# EAGLE design ISP_LPC9xx_USB_RE_v1.1 (EAGLE 5.11)
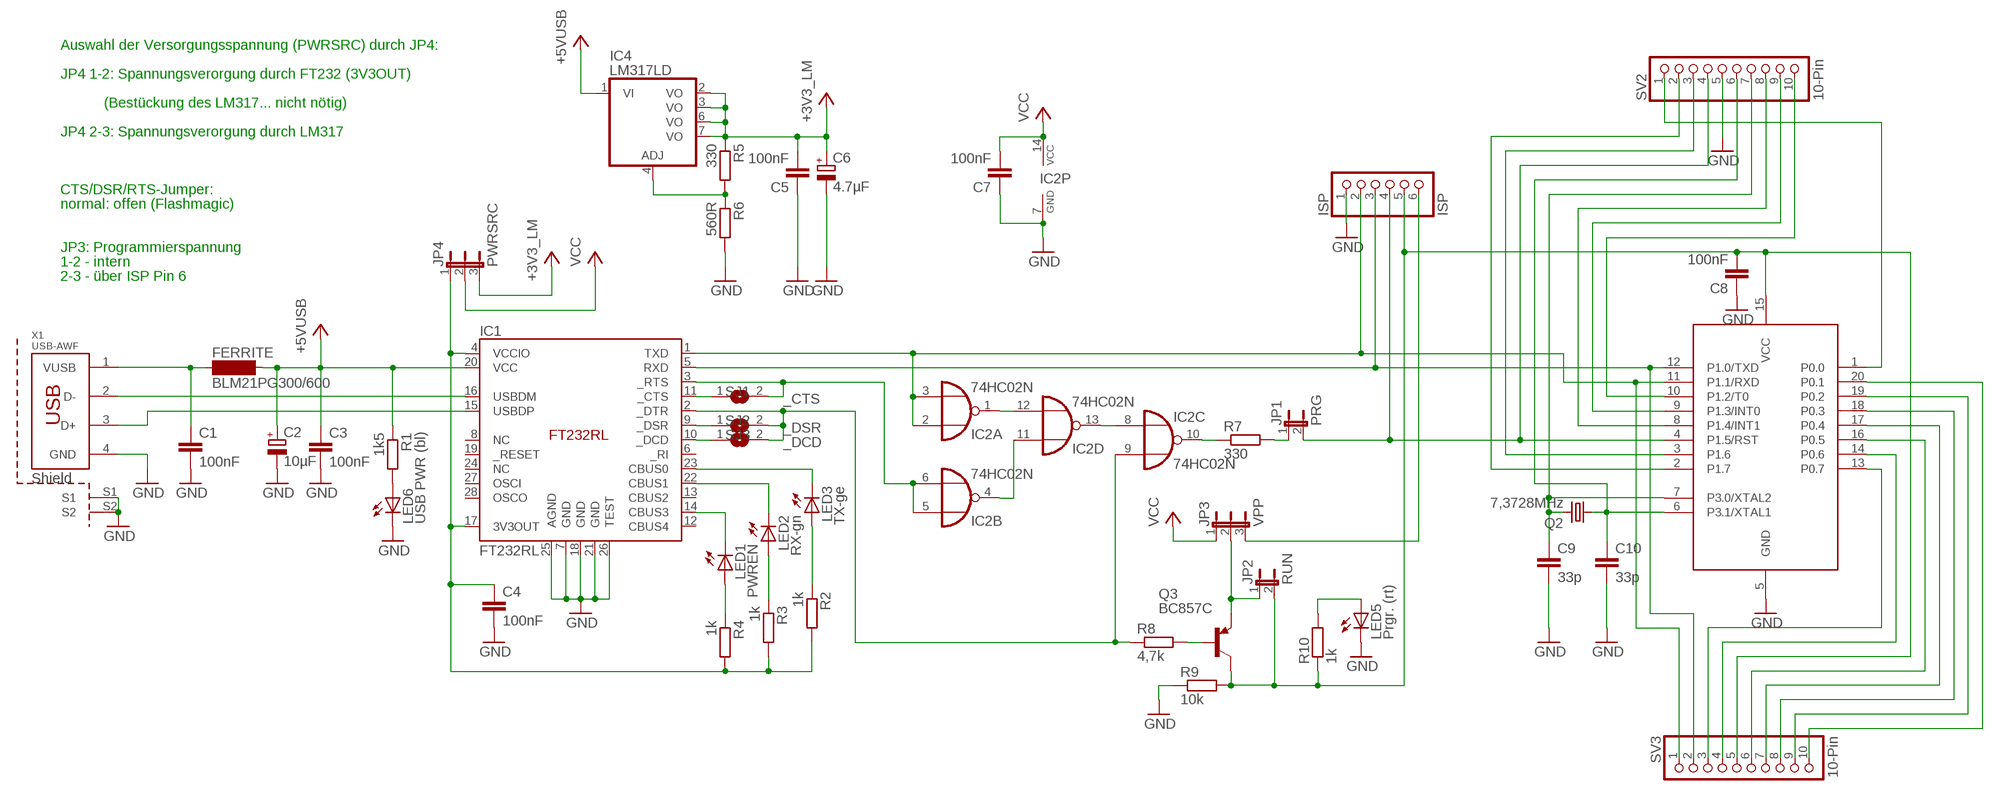
[diagram p0: schematic, sheet 1]

## Parts
C1  100nF  C-EUC0805K  [C0805K]
C2  10µF  CPOL-EU153CLV-0405  [153CLV-0405]
C3  100nF  C-EUC0805K  [C0805K]
C4  100nF  C-EUC0805K  [C0805K]
C5  100nF  C-EUC0805K  [C0805K]
C6  4.7µF  CPOL-EU153CLV-0405  [153CLV-0405]
C7  100nF  C-EUC0805K  [C0805K]
C8  100nF  C-EUC0805K  [C0805K]
C9  33p  C-EUC0805K  [C0805K]
C10  33p  C-EUC0805K  [C0805K]
FERRITE  BLM21PG300/600  SM-1206  [SM-1206]
IC1  FT232RL  [SSOP-28]
IC2  74HC02N  [DIL14]
IC4  LM317LD  [SO08]
ISP  ISP  PINHD-1X6  [1X06]
JP1  PRG  JP1E  [JP1]
JP2  RUN  JP1E  [JP1]
JP3  VPP  JP2E  [JP2]
JP4  PWRSRC  JP2E  [JP2]
LED1  PWREN  LEDCHIP-LED0805  [CHIP-LED0805]
LED2  RX-gn  LEDCHIP-LED0805  [CHIP-LED0805]
LED3  TX-ge  LEDCHIP-LED0805  [CHIP-LED0805]
LED5  Prgr. (rt)  LEDCHIP-LED0805  [CHIP-LED0805]
LED6  USB PWR (bl)  LEDCHIP-LED0805  [CHIP-LED0805]
Q2  7,3728MHz  CRYSTALHC49S  [HC49/S]
Q3  BC857C  BC857C-PNP-SOT23-BEC  [SOT23-BEC]
R1  1k5  R-EU_M1206  [M1206]
R2  1k  R-EU_M1206  [M1206]
R3  1k  R-EU_M1206  [M1206]
R4  1k  R-EU_M1206  [M1206]
R5  330  R-EU_M1206  [M1206]
R6  560R  R-EU_M1206  [M1206]
R7  330  R-EU_M1206  [M1206]
R8  4,7k  R-EU_M1206  [M1206]
R9  10k  R-EU_M1206  [M1206]
R10  1k  R-EU_M1206  [M1206]
SJ1  _CTS  SJ  [SJ]
SJ2  _DSR  SJ  [SJ]
SJ3  _DCD  SJ  [SJ]
SV2  10-Pin  PINHD-1X10  [1X10]
SV3  10-Pin  PINHD-1X10  [1X10]
U2  89LPC922  [DIL20]
X1  USB-AWF  USB-1X-2S-PLUG-A-THT  [USB-PLUG-A-THT-2S]

## Nets
+3V3: C5.2 C6.+ IC4.2(VO) IC4.3(VO) IC4.6(VO) IC4.7(VO) JP4.3 R5.1 ; supply symbol labelled +3V3_LM
+5V: C2.+ C3.1 FERRITE.2 IC1.20(VCC) IC4.1(VI) R1.1 ; supply symbol labelled +5VUSB
DSR_DCD_DTR: IC1.2(_DTR) IC2.9(C:I1) R8.1 SJ2.2 SJ3.2
GND: C1.2 C2.- C3.2 C4.2 C5.1 C6.- C7.1 C8.1 C9.2 C10.2 IC1.7(GND) IC1.18(GND) IC1.21(GND) IC1.25(AGND) IC1.26(TEST) IC2.7(P:GND) ISP.1 LED5.C LED6.C R6.2 R9.1 SV2.5 U2.5(GND) X1.4(GND) X1.S1 X1.S2
N$1: IC1.5(RXD) ISP.3 SV3.2 U2.12(P1.0/TXD)
N$2: C9.1 Q2.2 SV2.7 U2.7(P3.0/XTAL2)
N$3: IC2.4(B:O) IC2.11(D:I0)
N$4: JP2.1 JP3.2 Q3.E
N$5: ISP.4 JP1.2 SV2.4 U2.4(P1.5/RST)
N$6: C8.2 ISP.5 JP2.2 Q3.C R9.2 R10.1 SV3.5 U2.15(VCC)
N$7: ISP.6 JP3.3
N$8: IC1.1(TXD) IC2.2(A:I0) IC2.3(A:I1) ISP.2 SV3.1 U2.11(P1.1/RXD)
N$9: LED6.A R1.2
N$10: IC2.1(A:O) IC2.12(D:I1)
N$11: C10.1 Q2.1 SV2.6 U2.6(P3.1/XTAL1)
N$12: C4.1 IC1.4(VCCIO) IC1.17(3V3OUT) JP4.1 R2.2 R3.2 R4.2
N$13: LED5.A R10.2
N$14: IC1.16(USBDM) X1.2(D-)
N$15: IC2.8(C:I0) IC2.13(D:O)
N$16: IC4.4(ADJ) R5.2 R6.1
N$17: IC1.15(USBDP) X1.3(D+)
N$19: Q3.B R8.2
N$20: IC1.11(_CTS) SJ1.1
N$21: IC1.9(_DSR) SJ2.1
N$22: IC1.10(_DCD) SJ3.1
N$23: LED2.A R3.1
N$24: LED3.A R2.1
N$25: IC1.22(CBUS1) LED2.C
N$26: IC1.23(CBUS0) LED3.C
N$27: JP1.1 R7.2
N$28: IC2.10(C:O) R7.1
N$29: IC1.14(CBUS3) LED1.C
N$30: LED1.A R4.1
N$36: SV2.10 U2.10(P1.2/T0)
N$38: SV2.9 U2.9(P1.3/INT0)
N$39: SV2.8 U2.8(P1.4/INT1)
N$40: SV3.4 U2.14(P0.6)
N$41: SV2.3 U2.3(P1.6)
N$42: SV3.6 U2.16(P0.5)
N$43: SV2.2 U2.2(P1.7)
N$44: SV2.1 U2.1(P0.0)
N$45: SV3.3 U2.13(P0.7)
N$46: SV3.7 U2.17(P0.4)
N$47: C1.1 FERRITE.1 X1.1(VUSB)
N$48: SV3.8 U2.18(P0.3)
N$49: SV3.9 U2.19(P0.2)
N$50: SV3.10 U2.20(P0.1)
RTS_CTS1: IC1.3(_RTS) IC2.5(B:I0) IC2.6(B:I1) SJ1.2
VCC: C7.2 IC2.14(P:VCC) JP3.1 JP4.2
Unconnected: IC1.6(_RI) IC1.8(NC) IC1.12(CBUS4) IC1.13(CBUS2) IC1.19(_RESET) IC1.24(NC) IC1.27(OSCI) IC1.28(OSCO)

## Notes on the sheet
- Auswahl der Versorgungsspannung (PWRSRC) durch JP4:
- JP4 1-2: Spannungsverorgung durch FT232 (3V3OUT)
- (Bestückung des LM317... nicht nötig)
- JP4 2-3: Spannungsverorgung durch LM317
- CTS/DSR/RTS-Jumper:
- normal: offen (Flashmagic)
- JP3: Programmierspannung
- 1-2 - intern
- 2-3 - über ISP Pin 6

## Library data of the parts
C1 C3-C5 C7-C10 = rcl:C-EU: CAPACITOR, European symbol
C2 C6 = rcl:CPOL-EU: POLARIZED CAPACITOR, European symbol
FERRITE = inductor-neosid:SM-1206: INDUCTOR SMD chip inductor
IC1 = ftdi4:FT232RL
IC2 = 74xx-eu:74*02: Quad 2-input NOR gate
IC4 = linear:LM317LD: LOW CURRENT 1.2 TO 37V ADJUSTABLE VOLTAGE REGULATOR Source: http://pdf.alldatasheet.com
ISP = pinhead:PINHD-1X6: PIN HEADER
JP1 JP2 = jumper:JP1E: JUMPER
JP3 JP4 = jumper:JP2E: JUMPER
LED1-LED3 LED5 LED6 = led:LED: LED OSRAM: - CHIPLED LG R971, LG N971, LY N971, LG Q971, LY Q971, LO R971, LY R971 LH N974, LH R974 LS Q976, LO Q976, LY Q976 LO Q996 - Hyper CHIPLED LW Q18S LB Q993, LB Q99A, LB R99A - SideLED LS A670, LO A670, LY A670, LG A670, LP A670 LB A673, LV A673, LT A673, LW A673 LH A674 LY A675 LS A676, LA A676, LO A676, LY A676, LW A676 LS A679, LY A679, LG A679 - Hyper Micro SIDELED® LS Y876, LA Y876, LO Y876, LY Y876 LT Y87S - SmartLED LW L88C, LW L88S LB L89C, LB L89S, LG L890 LS L89K, LO L89K, LY L89K LS L896, LA L896, LO L896, LY L896 - TOPLED LS T670, LO T670, LY T670, LG T670, LP T670 LSG T670, LSP T670, LSY T670, LOP T670, LYG T670 LG T671, LOG T671, LSG T671 LB T673, LV T673, LT T673, LW T673 LH T674 LS T676, LA T676, LO T676, LY T676, LB T676, LH T676, LSB T676, LW T676 LB T67C, LV T67C, LT T67C, LS T67K, LO T67K, LY T67K, LW E67C LS E67B, LA E67B, LO E67B, LY E67B, LB E67C, LV E67C, LT E67C LW T67C LS T679, LY T679, LG T679 LS T770, LO T770, LY T770, LG T770, LP T770 LB T773, LV T773, LT T773, LW T773 LH T774 LS E675, LA E675, LY E675, LS T675 LS T776, LA T776, LO T776, LY T776, LB T776 LHGB T686 LT T68C, LB T68C - Hyper Mini TOPLED® LB M676 - Mini TOPLED Santana® LG M470 LS M47K, LO M47K, LY M47K Source: http://www.osram.convergy.de LUXEON: - LUMILED® LXK2-PW12-R00, LXK2-PW12-S00, LXK2-PW14-U00, LXK2-PW14-V00 LXK2-PM12-R00, LXK2-PM12-S00, LXK2-PM14-U00 LXK2-PE12-Q00, LXK2-PE12-R00, LXK2-PE12-S00, LXK2-PE14-T00, LXK2-PE14-U00 LXK2-PB12-K00, LXK2-PB12-L00, LXK2-PB12-M00, LXK2-PB14-N00, LXK2-PB14-P00, LXK2-PB14-Q00 LXK2-PR12-L00, LXK2-PR12-M00, LXK2-PR14-Q00, LXK2-PR14-R00 LXK2-PD12-Q00, LXK2-PD12-R00, LXK2-PD12-S00 LXK2-PH12-R00, LXK2-PH12-S00 LXK2-PL12-P00, LXK2-PL12-Q00, LXK2-PL12-R00 Source: www.luxeon.com KINGBRIGHT: KA-3528ASYC Source: www.kingbright.com
Q2 = crystal:CRYSTAL: CRYSTAL
Q3 = transistor:*-PNP-: PNP Transistror
R1-R10 = resistor:R-EU_: RESISTOR, European symbol
SJ1-SJ3 = jumper:SJ: SMD solder JUMPER
SV2 SV3 = pinhead:PINHD-1X10: PIN HEADER
U2 = micro-philips:89LPC922
X1 = _con-usb_1:USB-1X-2S: USB A/M USB Typ A / USB Typ B Ausführung SMD/THT/DIP, Side-Entry, Ultraflach 2x Shield Reichelt USB-AGF, USB-AWF

## Board
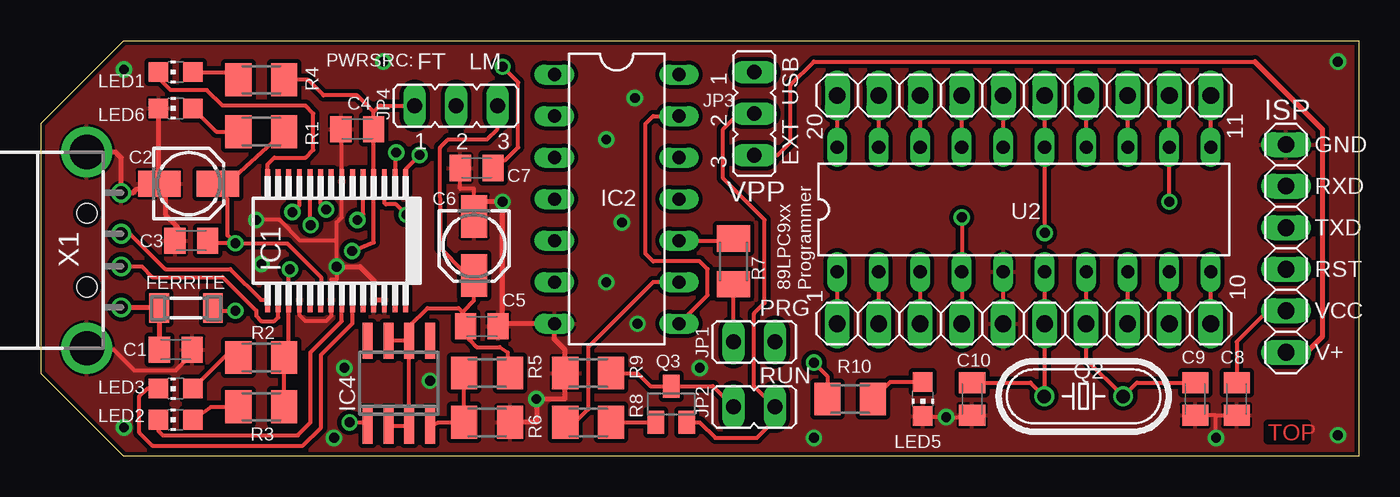
[diagram p1: board, top side]
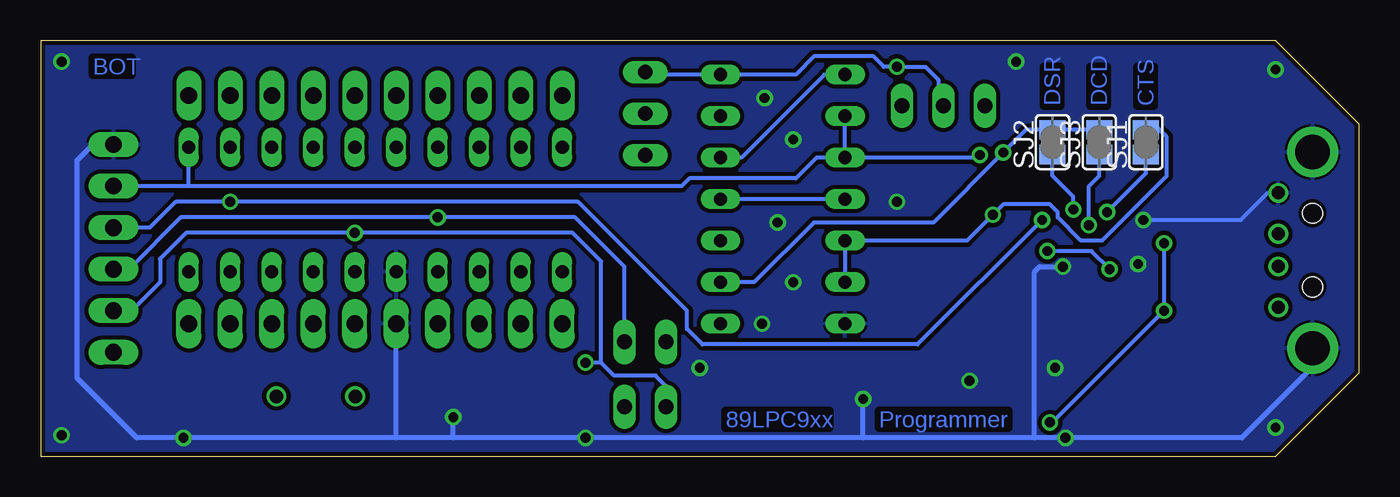
[diagram p2: board, bottom side, seen from below]

Size 80.65 x 25.4 mm. Coordinates in mm from the lower left corner, seen from the top.
Outline: 0,20.32 0,5.08 5.08,0 80.65,0 80.65,25.4 5.08,25.4 0,20.32
Copper layers (1*16): Top 0.035mm / dielectric 1.5mm / Bottom 0.035mm
Design rules "2layer_20110523": minimum track width 0.15mm, minimum drill 0.3mm, track to track 0.15mm, track to pad 0.15mm, pad to pad 0.15mm, via to via 0.15mm, smd to smd 0.15mm, copper to edge 0.15mm, drill to drill 0.2mm, minimum pad ring 0.15mm, minimum via ring 0.2mm, stop-mask expansion 0.15mm, vias tented up to drill 0.8mm, thermal gap 0.15mm

### Footprints (pad centres in the part's own frame; a part is rotated, then mirrored left to right if it is on the bottom)
C0805K = smd 1.3 x 1.6: 1 -1,0; 2 1,0
153CLV-0405 = smd 2.6 x 1.6: + 1.8,0; - -1.8,0
SM-1206 = smd 1.2 x 1.8: 1 -1.65,0; 2 1.65,0
SSOP-28 = smd 0.3 x 1.5: 1 -4.225,-3.625; 2 -3.575,-3.625; 3 -2.925,-3.625; 4 -2.275,-3.625; 5 -1.625,-3.625; 6 -0.975,-3.625; 7 -0.325,-3.625; 8 0.325,-3.625; 9 0.975,-3.625; 10 1.625,-3.625; 11 2.275,-3.625; 12 2.925,-3.625; 13 3.575,-3.625; 14 4.225,-3.625; 15 4.225,3.625; 16 3.575,3.625; 17 2.925,3.625; 18 2.275,3.625; 19 1.625,3.625; 20 0.975,3.625; 21 0.325,3.625; 22 -0.325,3.625; 23 -0.975,3.625; 24 -1.625,3.625; 25 -2.275,3.625; 26 -2.925,3.625; 27 -3.575,3.625; 28 -4.225,3.625
DIL14 = drill 0.813 long: 1 -7.62,-3.81; 2 -5.08,-3.81; 3 -2.54,-3.81; 4 0,-3.81; 5 2.54,-3.81; 6 5.08,-3.81; 7 7.62,-3.81; 8 7.62,3.81; 9 5.08,3.81; 10 2.54,3.81; 11 0,3.81; 12 -2.54,3.81; 13 -5.08,3.81; 14 -7.62,3.81
SO08 = smd 0.6 x 2.2: 1 -1.905,-2.6; 2 -0.635,-2.6; 3 0.635,-2.6; 4 1.905,-2.6; 5 1.905,2.6; 6 0.635,2.6; 7 -0.635,2.6; 8 -1.905,2.6
1X06 = drill 1.016 long: 1 -6.35,0; 2 -3.81,0; 3 -1.27,0; 4 1.27,0; 5 3.81,0; 6 6.35,0
JP1 = drill 0.914 long: 1 0,-1.27; 2 0,1.27
JP2 = drill 0.914 long: 1 -2.54,0; 2 0,0; 3 2.54,0
CHIP-LED0805 = smd 1.2 x 1.2: A 0,-1.05; C 0,1.05
HC49/S = drill 0.813 round: 1 -2.413,0; 2 2.413,0
SOT23-BEC = smd 1 x 1.4: B -0.95,-1.1; C 0,1.1; E 0.95,-1.1
M1206 = smd 1.6 x 2: 1 -1.4,0; 2 1.4,0
SJ = smd 1.168 x 1.6: 1 -0.762,0; 2 0.762,0
1X10 = drill 1.016 long: 1 -11.43,0; 2 -8.89,0; 3 -6.35,0; 4 -3.81,0; 5 -1.27,0; 6 1.27,0; 7 3.81,0; 8 6.35,0; 9 8.89,0; 10 11.43,0
DIL20 = drill 0.813 long: 1 -11.43,-3.81; 2 -8.89,-3.81; 3 -6.35,-3.81; 4 -3.81,-3.81; 5 -1.27,-3.81; 6 1.27,-3.81; 7 3.81,-3.81; 8 6.35,-3.81; 9 8.89,-3.81; 10 11.43,-3.81; 11 11.43,3.81; 12 8.89,3.81; 13 6.35,3.81; 14 3.81,3.81; 15 1.27,3.81; 16 -1.27,3.81; 17 -3.81,3.81; 18 -6.35,3.81; 19 -8.89,3.81; 20 -11.43,3.81
USB-PLUG-A-THT-2S = drill 0.8 round: 1 10,-3.6; 2 10,-1.1; 3 10,0.9; 4 10,3.4 | drill 2.1 round: S1 7.9,-6.1; S2 7.9,5.9 | hole 1.2: 7.9,-2.35; 7.9,2.15

### Placement (x,y rotation side)
C1  8.26,6.51 0 top
C2  9.05,16.67 0 top
C3  9.21,13.18 180 top
C4  19.37,20 180 top
C5  26.99,7.94 180 top
C6  26.51,12.86 270 top
C7  26.67,17.62 0 top
C8  73.18,3.49 90 top
C9  70.64,3.49 270 top
C10  56.99,3.49 270 top
FERRITE  8.89,9.05 0 top
IC1  18.1,13.18 180 top
IC2  35.24,15.72 270 top
IC4  21.91,4.45 0 top
ISP  76.2,12.7 270 top
JP1  43.66,6.98 270 top
JP2  43.66,3.02 90 top
JP3  43.66,20.96 270 top
JP4  25.4,21.43 0 top
LED1  8.26,23.49 90 top
LED2  8.26,2.22 90 top
LED3  8.26,4.13 90 top
LED5  53.97,3.49 180 top
LED6  8.26,21.27 90 top
Q2  63.82,3.65 0 top
Q3  38.58,3.17 0 top
R1  13.49,19.84 180 top
R2  13.49,6.03 0 top
R3  13.49,3.02 0 top
R4  13.49,23.02 0 top
R5  27.3,5.08 180 top
R6  27.31,2.06 0 top
R7  42.39,11.91 270 top
R8  33.5,2.06 0 top
R9  33.5,5.08 0 top
R10  49.53,3.49 0 top
SJ1  13.02,19.21 90 bottom
SJ2  18.73,19.21 90 bottom
SJ3  15.88,19.21 90 bottom
SV2  60.17,8.1 0 top
SV3  60.17,22.07 180 top
U2  60.17,15.08 0 top
X1  -5.08,12.7 0 top

### Tracks (layer width: path | path; a pad name or v marks a point on that pad's centre or on a via)
+3V3
  Top 0.254: IC4.2 IC4.3 IC4.6 | IC4.6 IC4.7 | IC4.6 22.54,7.94 23.65,9.05 25.56,9.05 25.83,8.78 | 25.83,8.78 C5.2 26.19,7.73 26.19,7.14 26.67,6.67 28.1,6.67 28.57,6.35 28.57,5.84 R5.1 | 26.51,11.27 C6.+ 26.51,11.27 | 26.51,11.27 | 26.51,11.27 25.88,11.27 24.45,12.7 24.45,18.89 24.92,19.37 27.3,19.37 27.94,20 JP4.3 | 26.51,11.27 26.51,9.52 25.83,8.84 25.83,8.78
+5V  (via drill 0.6)
  Top 0.254: R1.1 11.17,16.43 C2.+ 11.17,15.98 11.43,15.72 11.43,13.49 v11.91,13.02 | C3.1 10.37,13.02 v11.91,13.02 | IC1.20 17.14,9.57 17.14,10.95 15.08,13.02 v11.91,13.02 | FERRITE.2 10.79,9.05 10.95,8.89 v11.91,8.89 | IC4.1 19.94,2.06 v18.89,2.06
  Bottom 0.254: v11.91,8.89 12.07,8.73 | 12.07,8.73 | 12.07,8.73 18.73,2.06 v18.89,2.06 | 12.07,8.73 v11.91,8.89 | v11.91,8.89 v11.91,13.02
DSR_DCD_DTR  (via drill 0.6)
  Top 0.254: IC1.2 21.67,18.33 v21.75,18.57 | R8.1 32.7,2.06 33.5,2.86 33.5,6.67 37.46,10.64 IC2.9
  Bottom 0.254: IC2.9 36.99,10.64 33.34,14.29 26.04,14.29 v21.75,18.57 20.35,19.97 SJ2.2 SJ3.2
GND  (via drill 0.6)
  Top 0.254: IC1.7 | 18.1,13.18 v18.1,11.59 18.1,10.8 17.78,10.8 17.78,10.32 17.77,10.31 IC1.21 17.77,8.56 17.46,8.25 16.19,8.25 15.82,8.62 IC1.18 | 18.1,13.18 18.1,14.29 18.41,14.6 IC1.7 | SV2.5 U2.5 | U2.5 | C10.2 56.88,2.38 v55.4,2.38 54.04,2.38 LED5.C | 70.64,2.38 C9.2 71.91,2.49 | 71.91,2.49 C8.1 | v71.91,1.11 71.91,2.49 | C1.2 9.26,6.24 8.26,5.24 5.71,5.24 4.45,6.51 2.91,6.51 X1.S1 | IC1.7 18.41,20 C4.2 | v13.18,14.45 14.61,14.45 15.88,13.18 18.1,13.18 | C7.1 25.67,16.35 26.51,16.35 C6.- | C6.-
  Top 0.305: C5.1 28.15,8.1 28.26,8.1 | 28.26,8.1 IC2.7 31.43,7.14 32.07,6.51 32.07,5.11 R9.1 32.07,3.49 v30.32,3.49 30.32,2.06 R6.2 | 26.57,14.6 C6.- 26.51,15.56 v28.26,15.56 28.26,8.1 | C2.- 7.42,16.2 | C2.- 7.21,16.71 LED6.C | C3.2 8.37,14.02 7.62,14.76 7.62,16.3 C2.- | IC1.26 IC1.25 20.37,10.74 19.53,11.59 v18.1,11.59 | C2.- 7.57,16.35 5.87,16.35 5.62,16.1 X1.4 4.92,18.26 4.58,18.6 X1.S2
  Bottom 0.254: v13.18,14.45 7.21,14.45 5.56,16.1 X1.4
  Bottom 0.305: 30.32,1.11 55.4,1.11 | 30.32,1.11 v30.32,3.49 | 75.72,19.05 77.47,19.05 78.42,18.1 78.42,4.76 74.77,1.11 v71.91,1.11 58.9,1.11 | 19.84,1.11 v17.94,1.11 7.14,1.11 2.86,5.4 2.82,5.43 X1.S1 | 19.84,1.11 30.32,1.11 | 19.84,1.11 19.84,11.27 19.53,11.59 v18.1,11.59 | 55.4,1.11 v55.4,2.38 | 55.4,1.11 58.9,1.11 | 58.9,1.11 SV2.5
  other vias: 34.61,19.37 23.81,4.6 40.32,5.4 20.96,24.13 36.51,8.1 5.08,23.65 5.08,1.75 79.38,24.13 79.38,1.27 34.61,10.64 18.57,5.4 35.56,14.29 13.49,11.75 47.31,1.11 36.35,21.91
  pour Bottom (isolate 0.254): 0,20.32 5.08,25.4 80.65,25.4 80.65,0 5.08,0 0,5.08
  pour Top (isolate 0.254): 0,20.32 5.08,25.4 80.65,25.4 80.65,0 5.08,0 0,5.08
N$1  (via drill 0.6)
  Top 0.254: IC1.5 19.72,14.8 v19.37,14.45 | U2.12 SV3.2 | U2.12 | v69.06,15.56 U2.12
  Bottom 0.254: v19.37,14.45 26.99,6.83 40.16,6.83 41.12,7.78 41.12,8.89 47.78,15.56 v69.06,15.56 72.39,15.56 73.98,13.97 75.72,13.97 ISP.3
N$2
  Top 0.254: U2.7 SV2.7 63.98,5.91 Q2.2 67.07,4.49 C9.1 | U2.7
N$3
  Bottom 0.254: IC2.4 IC2.11
N$4
  Top 0.254: Q3.E 40.32,2.06 41.27,1.11 43.81,1.11 44.93,2.22 JP2.1 43.66,4.29 43.66,8.73 44.29,9.37 44.29,14.45 41.75,16.99 41.75,20 42.7,20.95 JP3.2
N$5  (via drill 0.6)
  Top 0.254: U2.4 SV2.4 | U2.4 | U2.4 56.36,14.29 v56.36,14.6
  Bottom 0.254: JP1.2 44.93,11.59 47.94,14.6 v56.36,14.6 72.07,14.6 75.25,11.43 75.72,11.43 ISP.4
N$6  (via drill 0.6)
  Top 0.254: R9.2 36.51,5.08 37.32,4.27 Q3.C 41.13,4.27 JP2.2 | U2.15 SV3.5 | U2.15 | v61.44,13.65 U2.15 | C8.2 73.18,6.98 75.09,8.89 75.72,8.89 ISP.5 | v47.31,5.71 48.13,4.89 R10.1
  Bottom 0.254: 46.35,5.71 45.56,4.92 43.02,4.92 42.39,4.29 JP2.2 | 46.35,5.71 46.35,11.91 48.1,13.65 v61.44,13.65 71.76,13.65 73.34,12.06 73.34,10.64 75.09,8.89 75.72,8.89 ISP.5 | 46.35,5.71 v47.31,5.71
N$7
  Top 0.254: JP3.3 45.08,18.41 | 45.08,18.41 | 45.08,18.41 45.88,19.21 45.88,22.7 47.31,24.13 74.3,24.13 | 77.47,6.35 75.72,6.35 ISP.6
  Top 0.305: 74.3,24.13 78.42,20 78.42,7.3 77.47,6.35
N$8  (via drill 0.6)
  Top 0.254: IC1.1 22.32,17.56 v23.18,18.41 | SV3.1 | U2.11 SV3.1
  Bottom 0.254: v23.18,18.41 23.65,18.26 IC2.3 | IC2.3 IC2.2 | IC2.3 33.18,18.26 34.45,16.99 40.96,16.99 41.43,16.51 71.6,16.51 | 71.6,16.51 ISP.2 | ISP.2 | 71.6,16.51 U2.11 | 71.6,16.51
N$9
  Top 0.254: LED6.A 10.73,19.84 R1.2
N$10
  Bottom 0.254: IC2.1 32.7,23.34 37.78,18.26 IC2.12
N$11
  Top 0.254: U2.6 SV2.6 61.44,3.65 Q2.1 60.56,4.49 C10.1 | U2.6
N$12  (via drill 0.6)
  Top 0.254: R3.2 R2.2 | R2.2 14.61,6.06 | 20.37,21.07 C4.1 IC1.4 20.37,13.07 v19.05,12.54 | v15.24,11.43 arc90 15.17,11.36 IC1.17 15.17,6.03 R2.2 | R4.2 16.35,23.02 17.3,22.07 19.37,22.07 20,21.43 20.37,21.07 | JP4.1 20.8,21.43 20.73,21.43 20.37,21.07
  Bottom 0.254: v15.24,11.43 16.35,12.54 v19.05,12.54
N$13
  Top 0.254: R10.2 51.98,4.54 LED5.A
N$14
  Top 0.254: IC1.16 14.52,8.49 14.29,8.25 13.49,8.25 13.18,8.57 13.18,8.89 11.11,10.95 6.83,10.95 6.18,11.6 X1.2
N$15
  Top 0.254: IC2.13 37.46,20.8 36.99,20.32 36.99,12.38 37.46,11.91 40.32,11.91 40.8,11.43 40.8,9.84 IC2.8
N$16
  Top 0.254: IC4.4 24.35,2.06 R6.1 25.91,2.54 R5.2
N$17
  Top 0.254: IC1.15 13.47,9.55 11.59,11.43 7.62,11.43 5.45,13.6 X1.3
N$19
  Top 0.254: R8.2 37.61,2.06 Q3.B
N$20  (via drill 0.6)
  Top 0.254: IC1.11 15.82,15.35 v15.4,14.92
  Bottom 0.254: v15.4,14.92 13.02,17.3 SJ1.1
N$21  (via drill 0.6)
  Top 0.254: IC1.9 17.12,15.42 v17.46,15.08
  Bottom 0.254: v17.46,15.08 17.46,15.88 18.73,17.14 SJ2.1 | SJ2.1
N$22  (via drill 0.6)
  Top 0.254: IC1.10 16.47,14.25 v16.51,14.13
  Bottom 0.254: v16.51,14.13 16.51,16.51 15.88,17.14 SJ3.1 | SJ3.1
N$23
  Top 0.254: R3.1 10.42,3.02 LED2.A
N$24
  Top 0.254: R2.1 11.53,6.35 LED3.A
N$25
  Top 0.254: LED2.C 7.21,1.53 7.46,1.27 15.72,1.27 16.51,2.06 16.51,6.35 18.41,8.25 IC1.22
N$26
  Top 0.254: LED3.C 6.51,4.13 6.03,3.65 6.03,1.43 6.83,0.63 16.03,0.63 17.14,1.75 17.14,6.19 19.07,8.12 IC1.23
N$27
  Top 0.254: JP1.1 R7.2 | JP1.1
N$28
  Top 0.254: IC2.10 42.26,13.18 R7.1
N$29
  Top 0.254: LED1.C 7.3,23.4 7.3,23.02 7.94,22.38 10.16,22.38 11.11,21.43 16.19,21.43 16.67,20.95 16.67,18.73 16.19,18.26 14.29,18.26 13.87,17.84 IC1.14
N$30
  Top 0.254: LED1.A 11.3,23.49 arc-90 R4.1
N$36
  Top 0.254: SV2.10 U2.10 | U2.10
N$38
  Top 0.254: SV2.9 U2.9 | U2.9
N$39
  Top 0.254: SV2.8 U2.8 | U2.8
N$40
  Top 0.254: U2.14 SV3.4 | U2.14
N$41
  Top 0.254: SV2.3 U2.3 | U2.3
N$42
  Top 0.254: U2.16 SV3.6 | U2.16
N$43
  Top 0.254: SV2.2 U2.2 | U2.2
N$44
  Top 0.254: SV2.1 U2.1 | U2.1
N$45
  Top 0.254: U2.13 SV3.3 | U2.13
N$46
  Top 0.254: U2.17 SV3.7 | U2.17
N$47
  Top 0.254: FERRITE.1 arc90 7.09,9.2 6.99,9.1 | 7.24,6.52 arc90 C1.1
  Top 0.305: FERRITE.1 7.24,6.52 | X1.1 6.99,9.1
N$48
  Top 0.254: U2.18 SV3.8 | U2.18
N$49
  Top 0.254: U2.19 SV3.9 | U2.19
N$50
  Top 0.254: U2.20 SV3.10 | U2.20
RTS_CTS1  (via drill 0.6)
  Top 0.254: IC1.3 21.02,15.49 21.11,15.4 21.75,15.4 v22.38,14.76
  Bottom 0.254: IC2.6 IC2.5 23.97,13.18 v22.38,14.76 21.75,15.4 18.89,15.4 18.41,14.92 18.41,14.6 16.99,13.18 15.72,13.18 11.75,17.14 11.75,19.53 12.22,20 12.99,20 SJ1.2
VCC  (via drill 0.6)
  Top 0.254: C7.2 28.1,18.1 28.42,18.1 29.21,18.89 29.21,22.86 v28.26,23.81
  Top 0.305: C7.2 27.78,17.62
  Bottom 0.254: JP3.1 43.5,23.34 IC2.14 34.45,23.34 33.34,24.45 29.69,24.45 29.05,23.81 v28.26,23.81 26.51,23.81 25.72,23.02 25.72,21.91 JP4.2

### Text on the board
Top: TOP
Bottom: BOT | CTS | DCD | DSR | Programmer | 89LPC9xx
tNames: PWRSRC: | FT | LM | USB | 20 | 11 | GND | EXT | VPP | RXD | TXD | 10 | RST | 89LPC9xx | 1 | Programmer | PRG | VCC | V+ | RUN